# Altium schematic sheet Power_Supply.SchDoc
size A3; SheetNumber: 1; SheetTotal: 3
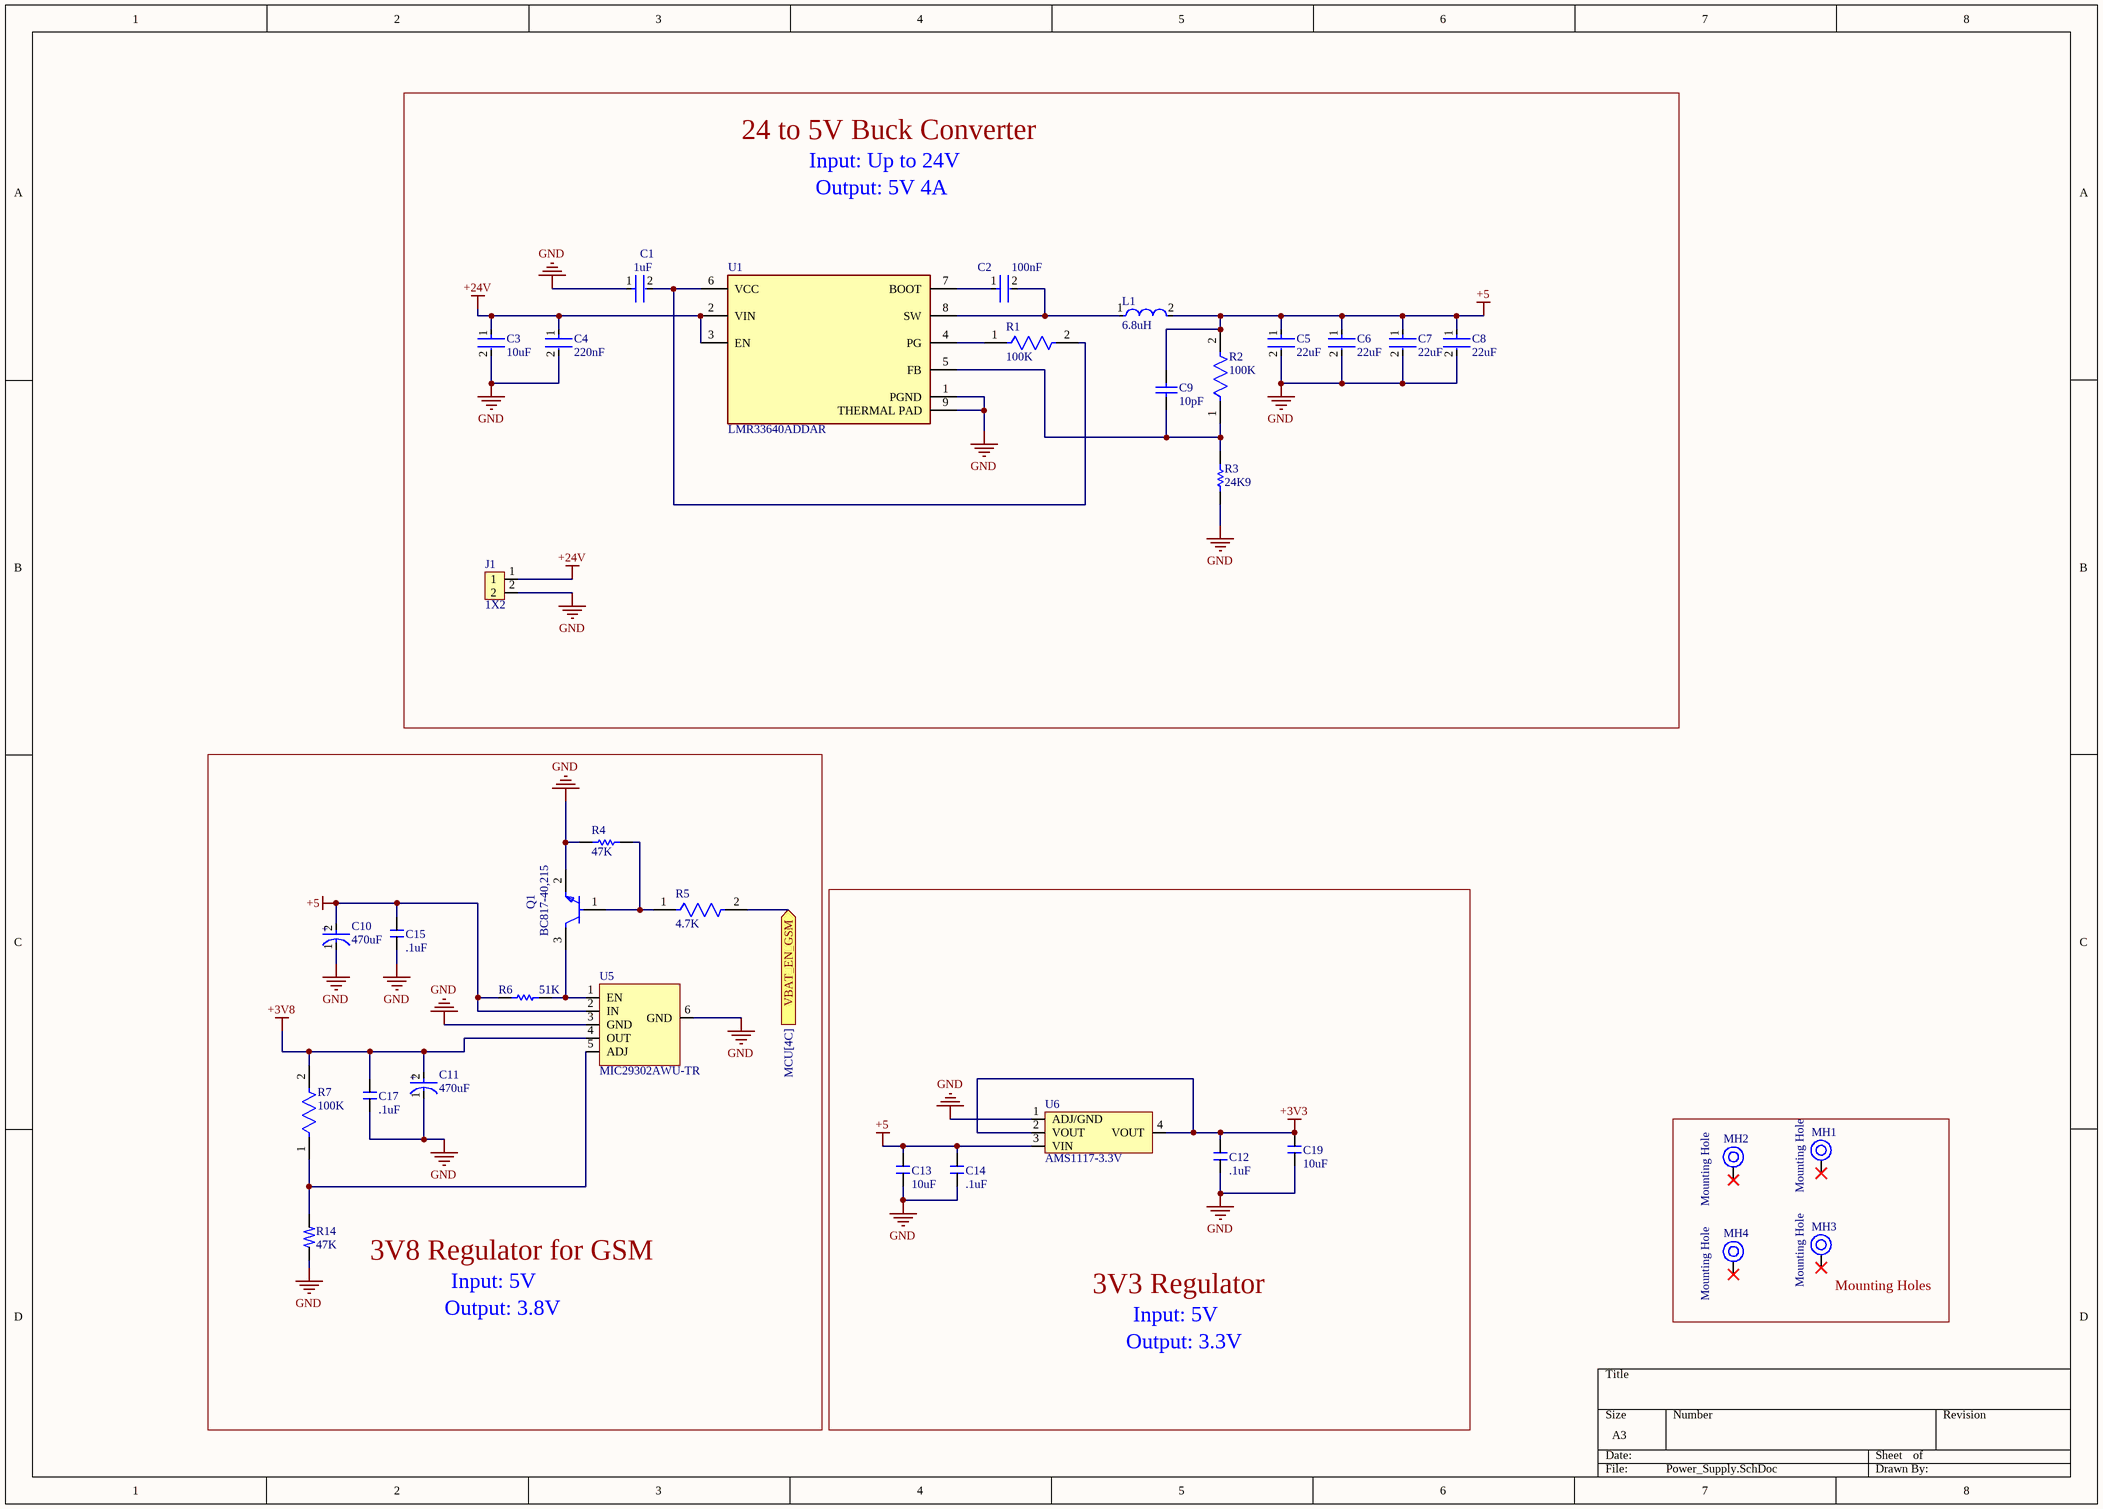
[diagram p0: Power_Supply.SchDoc]

## Parts
C1  1uF  [FP-CL21-IPC_C]
C2  100nF  [FP-CC0603-DA-MFG]
C3  10uF  [FP-CL31-IPC_C]
C4  220nF  [FP-C0805C-DN-MFG]
C5  22uF  [FP-CL21-IPC_C]
C6  22uF  [FP-CL21-IPC_C]
C7  22uF  [FP-CL21-IPC_C]
C8  22uF  [FP-CL21-IPC_C]
C9  10pF  [CAPC1608X90X40ML10T20]
C10  470uF  [FP-T491D477K006AT-MFG]
C11  470uF  [FP-T491D477K006AT-MFG]
C12  .1uF  [FB_0805]
C13  10uF  [Capacitor_0805]
C14  .1uF  [FB_0805]
C15  .1uF  [FB_0805]
C17  .1uF  [FB_0805]
C19  10uF  [Capacitor_0805]
J1  1X2  [Header 1x2 2.54mm]
L1  6.8uH  [FP-IHLP-2525CZ-FP_2_413x3-MFG]
MH1  Mounting Hole  [MOUNTING]
MH2  Mounting Hole  [MOUNTING]
MH3  Mounting Hole  [MOUNTING]
MH4  Mounting Hole  [MOUNTING]
Q1  BC817-40,215  [FP-SOT23-MFG]
R1  100K  [FP-RT0805-MFG]
R2  100K  [FP-RT0805-MFG]
R3  24K9  [RESC0805(2012)_L]
R4  47K  [RESC2013X60X35NL10T20]
R5  4.7K  [FP-CRCW0805-e3-IPC_B]
R6  51K  [RESC2013X50X30NL20T20]
R7  100K  [FP-RT0805-MFG]
R14  47K  [Resistor_0805]
U1  LMR33640ADDAR  [FP-DDA0008J-IPC_A]
U5  MIC29302AWU-TR  [TO-263-5]
U6  AMS1117-3.3V  [SOT-223]

## Blocks framed on the sheet
24 to 5V Buck Converter: C1-C9 J1 L1 R1-R3 U1
3V8 Regulator for GSM: C10 C11 C15 C17 Q1 R4-R7 R14 U5
3V3 Regulator: C12-C14 C19 U6
Mounting Holes: MH1-MH4

## Ports
VBAT_EN_GSM (in, see MCU[4C])

## Nets
+3V3: C12.1 C19.1 U6.2(VOUT) U6.4(VOUT)
+3V8: C11.2(A) C17.1 R7.2 U5.4(OUT)
+5: C5.1 C6.1 C7.1 C8.1 C9.2 C10.2(A) C13.1 C14.1 C15.1 L1.2 R2.2 R6.2 U5.2(IN) U6.3(VIN)
+24V: C3.1 C4.1 J1.1 U1.2(VIN) U1.3(EN)
GND: C1.1 C3.2 C4.2 C5.2 C6.2 C7.2 C8.2 C10.1(C) C11.1(C) C12.2 C13.2 C14.2 C15.2 C17.2 C19.2 J1.2 Q1.2(E) R3.1 R4.1 R14.1 U1.1(PGND) U1.9(THERMAL_PAD) U5.3(GND) U5.6(GND) U6.1(ADJ/GND)
VBAT_EN_GSM: R5.2 ; port VBAT_EN_GSM
NetC1_2: C1.2 R1.2 U1.6(VCC)
NetC2_1: C2.1 U1.7(BOOT)
NetC2_2: C2.2 L1.1 U1.8(SW)
NetC9_1: C9.1 R2.1 R3.2 U1.5(FB)
NetQ1_1: Q1.1(B) R4.2 R5.1
NetQ1_3: Q1.3(C) R6.1 U5.1(EN)
NetR1_1: R1.1 U1.4(PG)
NetR7_1: R7.1 R14.2 U5.5(ADJ)

Not connected (* = marked no-connect by the designer): MH1 1*; MH2 1*; MH3 1*; MH4 1*

## Notes on the sheet
- Input: Up to 24V
- Output: 5V 4A
- Output: 3.8V
- Input: 5V
- Output: 3.3V
- (in symbol CMP-03017-000053-1) +

## Library data of the parts
C1 = CMP-13271-001433-1: CL21 Series 0805 1uF 50V ±10% Tolerance X7R Multilayer Ceramic Chip Capacitor; Case Code (Metric): 2012; Max Operating Temperature: 125°C; Termination: Wraparound; Capacitance: 1uF; Voltage: 50V; Min Operating Temperature: -55°C; Packaging: Tape and Reel; Contact Plating: Tin; Case/Package: 0805; Depth: 1.25mm; Case Code (Imperial): 0805; Mount: Surface Mount; Material: Ceramic; Tolerance: 10%; Thickness: 0.053inch; Package Quantity: 3000; Voltage Rating: 50V; Width: 0.049inch; Length: 2mm; Dielectric: X7R
C2 = CMP-2100-03601-2: CAP CER 0.1UF 50V X7R 0603; Manufacturer: YAGEO; Manufacturer Part Number: CC0603KRX7R9BB104; Material: Ceramic; Temperature Coefficient: 15%; Tolerance: 0.1; Description: CC0603 100 nF X7R 10.00% 50 V; Height: 0.9mm; Voltage: 50 V; ComponentLink2Description: Datasheet; Device Class L2: Capacitors; Temperature Range High: +125°C; Category: Cap; Capacitance: 100 nF; Footprint Url: http://www.yageo.com/exep/pages/download/literatures/UPY-C_GEN_24.pdf; ComponentLink2URL: http://www.yageo.com/documents/recent/UPY-GPHC_X7R_6.3V-to-50V_18.pdf; Package: CC0603-DA; Temperature: -55°C to +125°C; Voltage Rating: 50 V; Temperature Characteristic: X7R; Device Class L1: Passive Components; Temperature Range Low: -55°C; RoHS: TRUE; Automotive: No; Value: 100 nF; Device Class L3: Ceramic Capacitors; Octopart: https://octopart.com/cc0603krx7r9bb104-yageo-42244635; Mouser Description: Multilayer Ceramic Capacitor, CC Series, 0.1 - F, - 10%, X7R, 50 V, 0603 [1608 Metric]; Lead Free: Yes; Digikey Description: CAP CER 0.1UF 50V X7R 0603
C3 = CMP-13271-000016-1: CAP CER 10UF 50V X5R 1206; Manufacturer: Samsung; Manufacturer Part Number: CL31A106KBHNNNE; Tolerance: 10%; Material: Ceramic; Temperature Coefficient: 15%; RoHS: TRUE; Ipc Land Pattern Name: CAPC320160X160; Temperature Range Low: -55°C; Value: 10uF; Device Class L3: Ceramic Capacitors; Category: Cap; Temperature Characteristic: X5R; Lead Free: Yes; Device Class L2: Capacitors; Octopart: https://octopart.com/cl31a106kbhnnne-samsung-19832778; ComponentLink2Description: Datasheet; Digikey Description: CAP CER 10UF 50V X5R 1206; Voltage: 50V; ComponentLink2URL: http://www.samsungsem.com/kr/support/product-search/mlcc/__icsFiles/afieldfile/2018/06/21/CL31A106KBHNNNE.pdf; Capacitance: 10uF; Temperature Range High: +85°C; Device Class L1: Passive Components; Height: 1.8mm; Automotive: No; Voltage Rating: 50V; Package: CL31; Temperature: -55°C to +85°C
C4 = CMP-1036-04552-2: CAP CER 0.22UF 50V X7R 0805; Manufacturer: KEMET; Manufacturer Part Number: C0805C224K5RACTU; Value: 0.22 μF; Description: C0805 0.22 μF X7R 30ppm/°C 10.00% 50 V; Temperature Coefficient: 30ppm/°C; Material: Ceramic; Tolerance: 0.1; ComponentLink2URL: https://content.kemet.com/datasheets/KEM_C1003_C0G_SMD.pdf; Temperature Characteristic: X7R; Device Class L3: Ceramic Capacitors; Lead Free: Yes; Temperature: -55°C to +125°C; RoHS: TRUE; Capacitance: 0.22 μF; Automotive: No; Octopart: https://octopart.com/c0805c224k5ractu-kemet-144670; Temperature Range Low: -55°C; Height: 0.88mm; Device Class L1: Passive Components; Digikey Description: CAP CER 0.22UF 50V X7R 0805; ComponentLink2Description: Datasheet; Mouser Description: CAP CER 0.22UF 50V X7R 0805; Category: Cap; Ipc Land Pattern Name: CAPC200125X78; Temperature Range High: +125°C; Package: C0805C-DN; Device Class L2: Capacitors; Voltage Rating: 50 V
C5-C8 = CMP-13271-002990-1: CL21 Series 0805 22uF 16V ±20% Tolerance X5R Multilayer Ceramic Chip Capacitor; Case Code (Imperial): 0805; Capacitance: 22uF; Max Operating Temperature: 85°C; Min Operating Temperature: -55°C; Packaging: Tape and Reel; Case Code (Metric): 2012; Case/Package: 0805; Mount: Surface Mount; Tolerance: 20%; Thickness: 0.037inch; Voltage Rating: 16V; Width: 0.049inch; Length: 0.079inch
C9 = CMP-2100-03593-1: Chip Capacitor, 10 pF, +/- 5%, 50 V, -55 to 125 degC, 0603 (1608 Metric), RoHS, Tape and Reel; Manufacturer: Yageo; Insulation Resistance: 100GR; Voltage Rating: 50V; Temperature Coefficient: 30ppm/degC; Dielectric: C0G; Radiation Hardening: No; Mount: SurfaceMount; Width: 0.031inch; Composition: Ceramic; Package Description: 2-Pin Surface Mount Device, Body 1.6 x 0.8 mm; Min Operating Temperature: -55degC; Case Code (Metric): 1608; Datasheet URL: http://www.yageo.com/documents/recent/UPY-GP_NP0_16V-to-50V_14.pdf; Termination: SMD/SMT; REACH SVHC: NoSVHC; Case/Package: 0603; RoHSCompliant: True; Packaging: TapeandReel; Max Operating Temperature: 125degC; Voltage: 50V; Package Quantity: 1; Manufacturer URL: http://www.yageo.com/; Tolerance: 5%; Capacitance: 10pF; Height: 0.8mm; Depth: 0.8mm; Thickness: 0.035inch; Case Code (Imperial): 0603; Length: 1.6mm; Package Reference: 0603; Voltage Rating (DC): 50V; Lead Free: LeadFree; Number of Pins: 2; Datasheet Version: Rev. 14, 07/2016
C10 C11 = CMP-03017-000053-1: CAP TANT 470UF 10% 6.3V 2917; Life (Hours): 2000Hour; Dissipation Factor: 12%; ESR (Equivalent Series Resistance): 400mR; Leakage Current: 19.8uA; Polarity: Polar; Ripple Current: 612mA; Dielectric Material: Tantalum; Construction: Flat; Series: T491; Height: 3.1mm; Capacitance: 470uF; REACH SVHC: No SVHC; Packaging: Tape and Reel; Failure Rate: 0.001%; Width: 0.169inch; Max Operating Temperature: 125°C; Package Quantity: 1; Lead Free: Lead Free; Case Code (Metric): 7343; Termination: SMD/SMT; Min Operating Temperature: -55°C; Voltage Rating (DC): 6.3V; Mount: Surface Mount; Depth: 4.3mm; Number of Pins: 2; Weight: 0.023634oz; Tolerance: 10%; Length: 7.3mm; Features: General Purpose; Voltage Rating: 6.3V; Radiation Hardening: No; Case Code (Imperial): 2917; RoHS Compliant: Yes; Case/Package: 2917; Height - Seated (Max): 0.122inch
C12 C14 C15 C17 = CAP .1 UF: Cap Ceramic 0.1uF 100V X7R 10% Pad SMD 0805 Fail Safe with Soft Termination 125C Automotive T/R; Manufacturer: Murata; Manufacturer Part Number: GCE21BR72A104KA01L; Material: 4241ConductorMaterial; Value: 100nF; Supplier: Mouser; Supplier Part Number: 81-GCE21BR72A104KA1L; RoHS: Yes; Category: Ceramic Capacitors; Stock: 45477; Pricing: 1=0,25, 10=0,152, 50=0,152, 100=0,1, 1000=0,073, 10000=0,055 (USD); Mounting Technology: Surface Mount; Case/Package: 0805; Case Code (Imperial): 0805; Case Code (Metric): 2012; Min Operating Temperature: -55°C; Max Operating Temperature: 125°C; Features: Soft Termination; Packaging: Cut Tape; Tolerance: 10%; Voltage Rating: 100V; Series: GCE; Length: 2mm; Width: 1.25mm; Height: 1.45mm; Thickness: 1.25mm; Ratings: AEC-Q200; Lead Free: Lead Free; RoHS Compliant: Yes; ComponentLink1URL: http://search.murata.co.jp/Ceramy/image/img/A01X/partnumbering_e_02.pdf?src-supplier=Digikey; ComponentLink1Description: http://search.murata.co.jp/Ceramy/image/img/A01X/partnumbering_e_02.pdf?src-supplier=Digikey; ComponentLink2URL: http://search.murata.co.jp/Ceramy/image/img/A01X/G101/ENG/GCE21BR72A104KA01-01.pdf?src-supplier=Digikey; ComponentLink2Description: http://search.murata.co.jp/Ceramy/image/img/A01X/G101/ENG/GCE21BR72A104KA01-01.pdf?src-supplier=Digikey
C13 C19 = CAP 10uF 0805: 16V 10uF X7R ±10% 0805 Multilayer Ceramic Capacitors MLCC - SMD/SMT ROHS; Manufacturer: Samsung; Manufacturer Part Number: CL21B106KOQNNNE; Material: 4241ConductorMaterial; Supplier: Digikey; Supplier Part Number: 1276-2872-1-ND; RoHS: Yes; Category: Ceramic Capacitors; Stock: 20461; Pricing: 1=0,09, 10=0,037, 100=0,0354 (USD); Mounting Technology: Surface Mount; Case/Package: 0805; Case Code (Metric): 2012; Case Code (Imperial): 0805; Min Operating Temperature: -55°C; Max Operating Temperature: 125°C; Tolerance: 10%; Packaging: Tape and Reel; Value: 10uF; Voltage Rating: 16V; Package Quantity: 1; Dielectric: X7R; Voltage: 16V; Series: CL; Construction: Flat; Voltage Rating (DC): 16V; Length: 2mm; Width: 0.049inch; Height: 1.25mm; Thickness: 0.055inch; Depth: 1.25mm; Radiation Hardening: No; RoHS Compliant: Yes; ComponentLink1URL: https://datasheet.ciiva.com/25794/cl21b106koqnnne-25794472.pdf?src-supplier=Digikey; ComponentLink1Description: https://datasheet.ciiva.com/25794/cl21b106koqnnne-25794472.pdf?src-supplier=Digikey; ComponentLink2URL: https://datasheet.ciiva.com/16428/cl21b106koqnnne-16428887.pdf?src-supplier=Future+Electronics; ComponentLink2Description: https://datasheet.ciiva.com/16428/cl21b106koqnnne-16428887.pdf?src-supplier=Future+Electronics; ComponentLink3URL: https://datasheet.ciiva.com/26920/getdatasheetpartid-355170-26920201.pdf?src-supplier=Verical; ComponentLink3Description: https://datasheet.ciiva.com/26920/getdatasheetpartid-355170-26920201.pdf?src-supplier=Verical
J1 = Header 1X2 2.54 mm: Conn Unshrouded Header HDR 2 POS 2.54mm Solder ST Thru-Hole Automotive Carton; Manufacturer: TE Connectivity; Manufacturer Part Number: 826629-2; Contact Style: 4753ConnectorType; Insulation Resistance: 5GR; Number of Contacts: 2NUMBER; Gender: 29Gender; Current Rating: 5A; Supplier: Avnet; Supplier Part Number: 826629-2; RoHS: Yes; Category: Headers and Wire Housings; Stock: 21749; Pricing: 1=0,15044, 10=0,14915, 30=0,14703, 50=0,14491, 100=0,14279 (USD); Pins: 2NUMBER; Contact Plating: 154,157ConductorMaterial; Color: 49Colour; Housing Color: 49Colour; Housing Material: 175ConductorMaterial; Orientation: 5495OrientationType; Height: 10mm; Lead Pitch: 2.54mm; Row Spacing: 2.54mm; RoHS Compliant: 5897YesNo; Lead Free: 5697LeadFree; ComponentLink1URL: https://www.te.com/commerce/DocumentDelivery/DDEController?Action=srchrtrv&amp;DocNm=826629&amp;DocType=Customer+Drawing&amp;DocLang=English&src-supplier=Digikey; ComponentLink1Description: https://www.te.com/commerce/DocumentDelivery/DDEController?Action=srchrtrv&amp;DocNm=826629&amp;DocType=Customer+Drawing&amp;DocLang=English&src-supplier=Digikey; ComponentLink2URL: https://datasheet.octopart.com/826629-2-TE-Connectivity---AMP-datasheet-17024315.pdf?src-supplier=Element14; ComponentLink2Description: https://datasheet.octopart.com/826629-2-TE-Connectivity---AMP-datasheet-17024315.pdf?src-supplier=Element14; ComponentLink3URL: https://datasheet.octopart.com/826629-2-TE-Connectivity---AMP-datasheet-179310416.pdf?src-supplier=Farnell; ComponentLink3Description: https://datasheet.octopart.com/826629-2-TE-Connectivity---AMP-datasheet-179310416.pdf?src-supplier=Farnell; ComponentLink4URL: https://datasheet.octopart.com/826629-2-TE-Connectivity---AMP-datasheet-44414285.pdf?src-supplier=Electro+Sonic; ComponentLink4Description: https://datasheet.octopart.com/826629-2-TE-Connectivity---AMP-datasheet-44414285.pdf?src-supplier=Electro+Sonic; ComponentLink5URL: https://datasheet.octopart.com/826629-2-TE-Connectivity-datasheet-181566106.pdf?src-supplier=Sager+Electronics; ComponentLink5Description: https://datasheet.octopart.com/826629-2-TE-Connectivity-datasheet-181566106.pdf?src-supplier=Sager+Electronics
L1 = CMP-02424-000391-1: Automotive Inductors, High Saturation Series 6.8uH 4.5A 60mΩ 20%; Shielding: Shielded; Test Frequency: 100kHz; Resistance: 0.06R; DC Resistance (DCR): 60mR; Packaging: Tape and Reel; Tolerance: 20%; Military Standard: Not; Max Operating Temperature: 125°C; Lead Free: Lead Free; Inductance: 6.8uH; Width: 6.48mm; Length: 7.24mm; Case/Package: 2525; Min Operating Temperature: -55°C; Depth: 6.72mm
MH1-MH4 = MH_3.5H_6D: Manufacturer Part Number: NA; Case/Package: TH; Manufacturer: NA; Supplier-1: NA; Supplier Part Number-1: NA; Alternate Part Number-1: NA
Q1 = CMP-14406-000007-1: TRANS NPN 45V 0.5A SOT23; Manufacturer: Nexperia; Collector Emitter Saturation Voltage: 700mV; Power Dissipation: 250mW; Collector Base Voltage: 50V; Unity Gain Freq: 100MHz; Hfe Max: 600; Rthja Max: 500K/W; Emitter Base Voltage: 5V; Max Collector Current: 500mA; Hfe Testvce: 1V; Automotive Grade: Grade 0; Hfe Min: 250; Description: Bipolar (BJT) Transistor NPN 45V 500mA 100MHz 250mW Surface Mount TO-236AB; Max Junction Temp: +150°C; Number Of Npn: 1; Hfe Testic: 100mA; Octopart: https://octopart.com/bc817-40%2C215-nexperia-78739081; Lead Free: Yes; Ipc Land Pattern Name: SOT95P230X100-3; Manufacturer Part Number: BC817-40,215; RoHS: TRUE; Collector Emitter Breakdown Voltage: 45V; Digikey Description: TRANS NPN 45V 0.5A SOT23; ComponentLink2URL: https://assets.nexperia.com/documents/data-sheet/BC817_SER.pdf; Temperature Range High: +150°C; Mouser Description: BC817 Series 45 V 500 mA 250 mW SMT NPN General-Purpose Transistor - SOT-23-; Device Class L3: BJTs; Temperature: to +150°C; Height: 1.1mm; Automotive: Yes; Ambient Temperature Range Low: -65°C; Package: SOT23; Collector Emitter Voltage: 45V; Category: Trans; ComponentLink2Description: Datasheet; Device Class L2: Transistors; Ambient Temperature Range High: +150°C; Number Of Elements: 1; Device Class L1: Discrete Semiconductors; Footprint Url: https://assets.nexperia.com/documents/outline-drawing/SOT23.pdf
R1 R2 R7 = CMP-2001-01711-2: RES SMD 100K OHM 0.1% 1/8W 0805; Manufacturer Part Number: RT0805BRD07100KL; Manufacturer: Yageo; Voltage Rating: 150V; Tolerance: 0.0025; Power Rating: 0.125W; Temperature Coefficient: 25 ppm/°C; Resistance: 100KΩ; Value: 100KΩ; Description: RT0805 100KΩ 0.125W 25 ppm/°C 0.25%; Footprint Url: http://www.yageo.com/exep/pages/download/literatures/PYu-R_Mount_10.pdf; Temperature Range Low: -55°C; Device Class L1: Passive Components; ComponentLink2Description: Datasheet; Composition: Thin Film; Automotive: No; Category: Res; Height: 0.6mm; Lead Free: Yes; Series: RT; Device Class L3: Chip SMD Resistors; Octopart: https://octopart.com/rt0805brd07100kl-yageo-1388347; Mouser Description: Thin Film Resistors - SMD 100K ohm 0.1% 1/8W; Package: RT0805; Temperature: -55°C to +155°C; Device Class L2: Resistors; Ipc Land Pattern Name: RESC200125X50; Digikey Description: RES SMD 100K OHM 0.1% 1/8W 0805; RoHS: TRUE; ComponentLink2URL: http://www.yageo.com/documents/recent/PYu-RT_1-to-0.01_RoHS_L_9.pdf; Temperature Range High: +155°C
R3 = CMP-1013-00666-1: 24K9 0.125W 1% 0805 (2012 Metric)  SMD; Case-EIA: 0805; Value: 24900.00 Ohm; Case-Metric: 2012; Power: 0.125 W; Tolerance: 1 %; Technology: SMT
R4 = CMP-1659-00011-4: Chip Resistor, 47 KOhm, +/- 1%, 0.125 W, -55 to 155 degC, 0805 (2012 Metric), RoHS, Tape and Reel; Manufacturer: Yageo; Voltage Rating: 150 V; Height: 0.5 mm; ComponentLink2URL: http://www.yageo.com/documents/recent/PYu-RC_Group_51_RoHS_L_04.pdf; ComponentLink2Description: Datasheet; Package Quantity: 200; Max Operating Temperature: 155 degC; Min Operating Temperature: -55 degC; Packaging: Tape and Reel; Pins: 2; PackageReference: 0805; Mounting Technology: Surface Mount; ComponentLink1Description: Manufacturer URL; ComponentLink1URL: http://www.yageo.com/; PackageDescription: 2-Pin Surface Mounted Device, Body 2 x 1.25 mm; Length: 2 mm; REACH SVHC: No SVHC; Mount: Surface Mount; RoHSCompliant: true; DatasheetVersion: Rev. 4, 02/2016
R5 = CMP-2100-03615-2: RES Thick Film, 4.7kΩ, 1%, 0.125W, 100ppm/°C, 0805; Max Power Dissipation: 125mW; Resistance: 4.7kR; Voltage Rating: 150V; Termination: SMD/SMT; Weight: 0.000194oz; Case/Package: 0805; Number of Terminations: 2; Min Operating Temperature: -55°C; Case Code (Metric): 2012; Package Quantity: 10; Depth: 1.25mm; Military Standard: Not; Composition: Thick Film; Radiation Hardening: No; Contact Plating: Tin; Height: 0.45mm; Power Rating: 125mW; Features: Automotive AEC-Q200; Tolerance: 1%; Packaging: Tape and Reel; Max Operating Temperature: 155°C; Length: 2mm; Case Code (Imperial): 0805; Voltage Rating (DC): 150V; Width: 1.25mm; Temperature Coefficient: 100ppm/°C; Lead Free: Lead Free
R6 = CMP-2001-03993-1: Manufacturer: Vishay Dale; Part Number: CRCW080551K0FKEA
R14 = RES 47K 0805: 125Mw Thick Film Resistors 100Ppm/ 1% 47K 0805 Chip Resistor Surface Mount Rohs; Manufacturer: Yageo; Manufacturer Part Number: RC0805FR-0747KL; Value: 47kR; Temperature Coefficient: 100ppm/°C; Voltage Rating (DC): 150V; Supplier: Avnet; Supplier Part Number: RC0805FR-0747KL; RoHS: Yes; Category: Chip SMD Resistors; Stock: 70000; Pricing: 5000=0,00212, 10000=0,00209, 20000=0,00206, 30000=0,00203, 40000=0,00202 (USD); Case/Package: 0805; Pins: 2; Contact Plating: Tin,Matte; Case Code (Imperial): 0805; Case Code (Metric): 2012; Min Operating Temperature: -55°C; Max Operating Temperature: 155°C; Tolerance: 1%; Packaging: Tape and Reel; Resistor Type: Thick Film; Termination: SMD/SMT; Series: RC; Voltage Rating: 150V; Power Rating: 125mW; Features: Moisture Resistant; Max Power Dissipation: 125mW; Number of Terminations: 2; Resistance Tolerance: 1%; Voltage Rating (AC): 150V; Working Voltage: 150V; Length: 2mm; Width: 1.25mm; Height: 0.5mm; Reach SVHC Compliant: Unknown; RoHS Compliant: Yes; Lead Free: 5697LeadFree; ComponentLink1URL: https://datasheet.ciiva.com/7941/1686128-7941799.pdf?src-supplier=Element14; ComponentLink1Description: https://datasheet.ciiva.com/7941/1686128-7941799.pdf?src-supplier=Element14; ComponentLink2URL: https://datasheet.ciiva.com/46447/444164-46447581.pdf?src-supplier=Element14; ComponentLink2Description: https://datasheet.ciiva.com/46447/444164-46447581.pdf?src-supplier=Element14; ComponentLink3URL: https://datasheet.ciiva.com/7941/444164-7941800.pdf?src-supplier=Element14; ComponentLink3Description: https://datasheet.ciiva.com/7941/444164-7941800.pdf?src-supplier=Element14; ComponentLink4URL: https://datasheet.ciiva.com/7941/444164-7941801.pdf?src-supplier=Element14; ComponentLink4Description: https://datasheet.ciiva.com/7941/444164-7941801.pdf?src-supplier=Element14; ComponentLink5URL: https://datasheet.ciiva.com/16742/rc0805-16742265.pdf?src-supplier=Future+Electronics; ComponentLink5Description: https://datasheet.ciiva.com/16742/rc0805-16742265.pdf?src-supplier=Future+Electronics
U1 = CMP-04918-000399-1: 36V 4A 400KHZ REGULATOR
U5 = LDO MIC29302AWU-TR: IC REG LDO ADJ 3A TO263-5; Manufacturer: Microchip; Supplier: Farnell; Supplier Part Number: 2851564RL; Manufacturer Part Number: MIC29302AWU-TR; RoHS: Yes; Category: Voltage Regulators - Linear; Stock: 814; Pricing: 100=1,91, 750=1,87 (EUR); ComponentLink1URL: https://datasheet.ciiva.com/13026/mic29150-13026090.pdf?src-supplier=Mouser; ComponentLink1Description: https://datasheet.ciiva.com/13026/mic29150-13026090.pdf?src-supplier=Mouser; ComponentLink2URL: https://datasheet.ciiva.com/16467/mic29302a-16467068.pdf?src-supplier=Future+Electronics; ComponentLink2Description: https://datasheet.ciiva.com/16467/mic29302a-16467068.pdf?src-supplier=Future+Electronics; ComponentLink3URL: https://datasheet.ciiva.com/2054/mic29302a-2054246.pdf?src-supplier=Digikey; ComponentLink3Description: https://datasheet.ciiva.com/2054/mic29302a-2054246.pdf?src-supplier=Digikey; ComponentLink4URL: https://datasheet.ciiva.com/2054/mic29302a-2054247.pdf?src-supplier=Digikey; ComponentLink4Description: https://datasheet.ciiva.com/2054/mic29302a-2054247.pdf?src-supplier=Digikey; ComponentLink5URL: https://datasheet.ciiva.com/2054/mic29302a-2054248.pdf?src-supplier=Digikey; ComponentLink5Description: https://datasheet.ciiva.com/2054/mic29302a-2054248.pdf?src-supplier=Digikey
U6 = AMS1117-3.3V: 1A Fixed 3.3V 18V SOT-223 Voltage Regulators - Linear, Low Drop Out (LDO) Regulators ROHS; Manufacturer: Tech Public; Supplier: LCSC; Supplier Part Number: C20611856; Manufacturer Part Number: AMS1117-3.3V; RoHS: No; Category: LDO; Stock: 2690; Pricing: 10=0,0402, 100=0,0315, 300=0,0271, 1000=0,0239, 4000=0,0213, 8000=0,02 (USD)